# EAGLE design SensorStick (EAGLE 7.6.0)
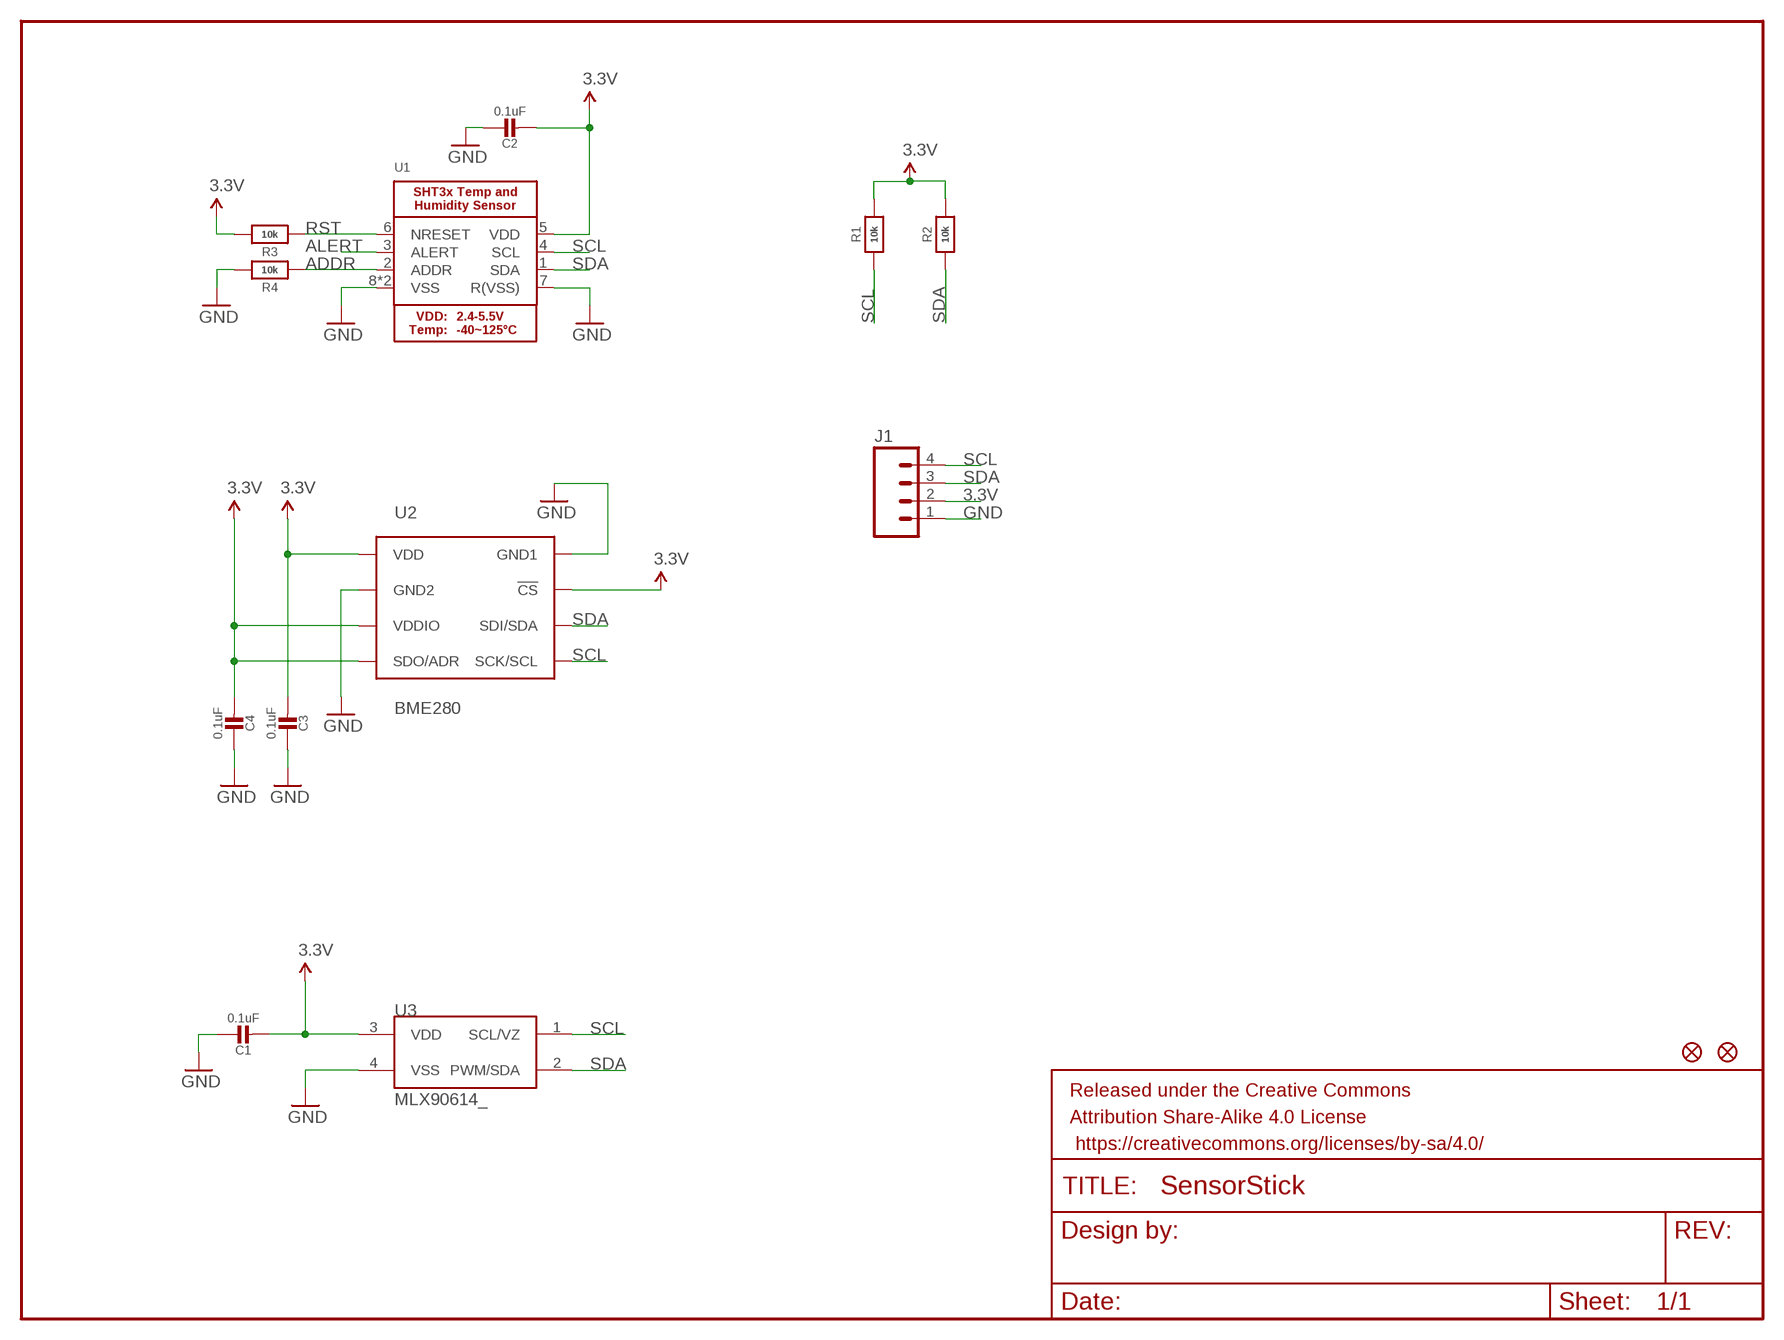
[diagram p0: schematic, sheet 1]

## Parts
C1  0.1uF  CAP_CERAMIC_0805  [_0805]
C2  0.1uF  CAP_CERAMIC_0805  [_0805]
C3  0.1uF  CAP_CERAMIC_0805  [_0805]
C4  0.1uF  CAP_CERAMIC_0805  [_0805]
FID1  SPARKFUN-AESTHETICS_FIDUCIAL1X2  [SPARKFUN-AESTHETICS_FIDUCIAL-1X2]
FID2  SPARKFUN-AESTHETICS_FIDUCIAL1X2  [SPARKFUN-AESTHETICS_FIDUCIAL-1X2]
FRAME1  FRAME-LETTERNO_PACKAGE  [DUMMY]
J1  M04PTH  [1X04]
R1  10k  RESISTOR_0805  [_0805]
R2  10k  RESISTOR_0805  [_0805]
R3  10k  RESISTOR_0805  [_0805]
R4  10k  RESISTOR_0805  [_0805]
U1  SHT3X  [SHT3X]
U2  BME280  BME280COMPONENTLIBRARY_BME280  [BME280COMPONENTLIBRARY_BME280_LGA]
U3  MLX90614_  [TO-39]

## Nets
3.3V: C1.2 C2.2 C3.2 C4.2 J1.2 R1.2 R2.2 R3.2 U1.5(VDD) U2.P$2(!CS) U2.P$5(SDO/ADR) U2.P$6(VDDIO) U2.P$8(VDD) U3.3(VDD)
ADDR: R4.1 U1.2(ADDR)
ALERT: U1.3(ALERT)
GND: C1.1 C2.1 C3.1 C4.1 J1.1 R4.2 U1.7(R(VSS)) U1.8(VSS) U1.THERMAL(VSS) U2.P$1(GND1) U2.P$7(GND2) U3.4(VSS)
RST: R3.1 U1.6(NRESET)
SCL: J1.4 R1.1 U1.4(SCL) U2.P$4(SCK/SCL) U3.1(SCL/VZ)
SDA: J1.3 R2.1 U1.1(SDA) U2.P$3(SDI/SDA) U3.2(PWM/SDA)

## Library data of the parts
C1-C4 = Adafruit-SHT31-Breakout:CAP_CERAMIC: Ceramic Capacitors For new designs, use the packages preceded by an '_' character since they are more reliable: The following footprints should be used on most boards: _0402 - Standard footprint for regular board layouts _0603 - Standard footprint for regular board layouts _0805 - Standard footprint for regular board layouts _1206 - Standard footprint for regular board layouts For extremely tight-pitch boards where space is at a premium, the following 'micro-pitch' footprints can be used (smaller pads, no silkscreen outline, etc.): _0402MP - Micro-pitch footprint for very dense/compact boards _0603MP - Micro-pitch footprint for very dense/compact boards _0805MP - Micro-pitch footprint for very dense/compact boards _1206MP - Micro-pitch footprint for very dense/compact boards
FID1 FID2 = SparkFun_BME280_Breakout:SPARKFUN-AESTHETICS_FIDUCIAL: Fiducial Alignment Points Various fiducial points for machine vision alignment.
FRAME1 = SparkFun-Aesthetics:FRAME-LETTER: Schematic Frame Standard 8.5x11 US Letter frame; DESIGNER: Nobody; VERSION: v01
J1 = SparkFun-Connectors:M04: Header 4 Standard 4-pin 0.1" header. Use with straight break away headers (SKU : PRT-00116), right angle break away headers (PRT-00553), swiss pins (PRT-00743), machine pins (PRT-00117), and female headers (PRT-00115). Molex polarized connector foot print use with SKU : PRT-08231 with associated crimp pins and housings. 1MM SMD Version SKU: PRT-10208; PROD_ID: CONN-09696
R1-R4 = Adafruit-SHT31-Breakout:RESISTOR: Resistors For new designs, use the packages preceded by an '_' character since they are more reliable: The following footprints should be used on most boards: _0402 - Standard footprint for regular board layouts _0603 - Standard footprint for regular board layouts _0805 - Standard footprint for regular board layouts _1206 - Standard footprint for regular board layouts For extremely tight-pitch boards where space is at a premium, the following 'micro-pitch' footprints can be used (smaller pads, no silkscreen outline, etc.): _0402MP - Micro-pitch footprint for very dense/compact boards _0603MP - Micro-pitch footprint for very dense/compact boards _0805MP - Micro-pitch footprint for very dense/compact boards _1206MP - Micro-pitch footprint for very dense/compact boards
U1 = Adafruit-SHT31-Breakout:SHT3X: SHT3x - Digital Temperature and Humidity Sensor Supply Voltage: 2.4-5.5V Humidity Accuracy: SHT30 = +/-3%RH, SHT31 = +/-2%RH Temperature Sensor: -40~125°C (+/-0.3°C from 10-55C)
U2 = SparkFun_BME280_Breakout:BME280COMPONENTLIBRARY_BME280; PROD_ID: IC-13090
U3 = SparkFun_MLX90614_Eval:MLX90614: Melexis IR Thermometer

## Board
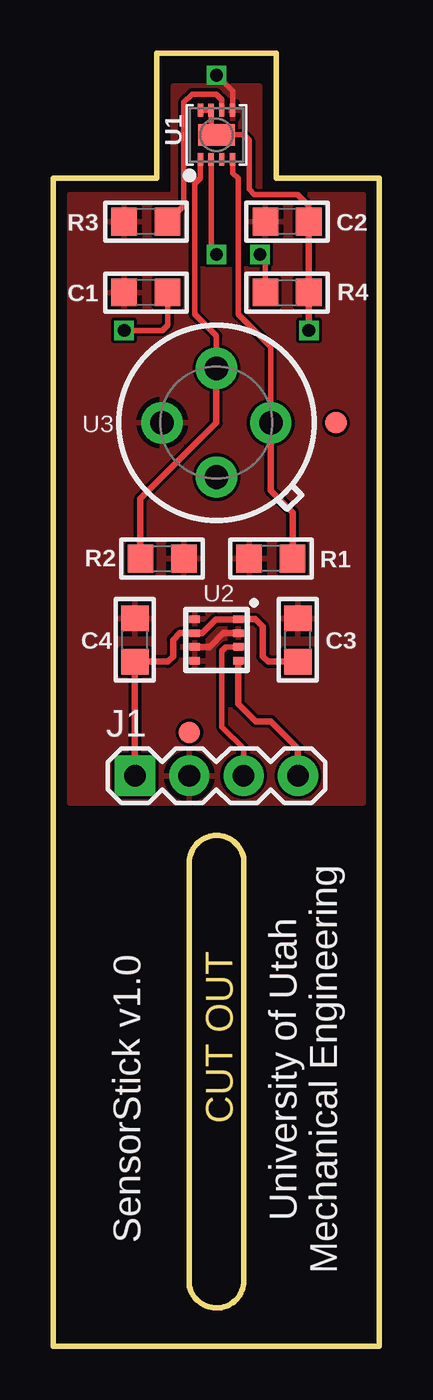
[diagram p1: board, top side]
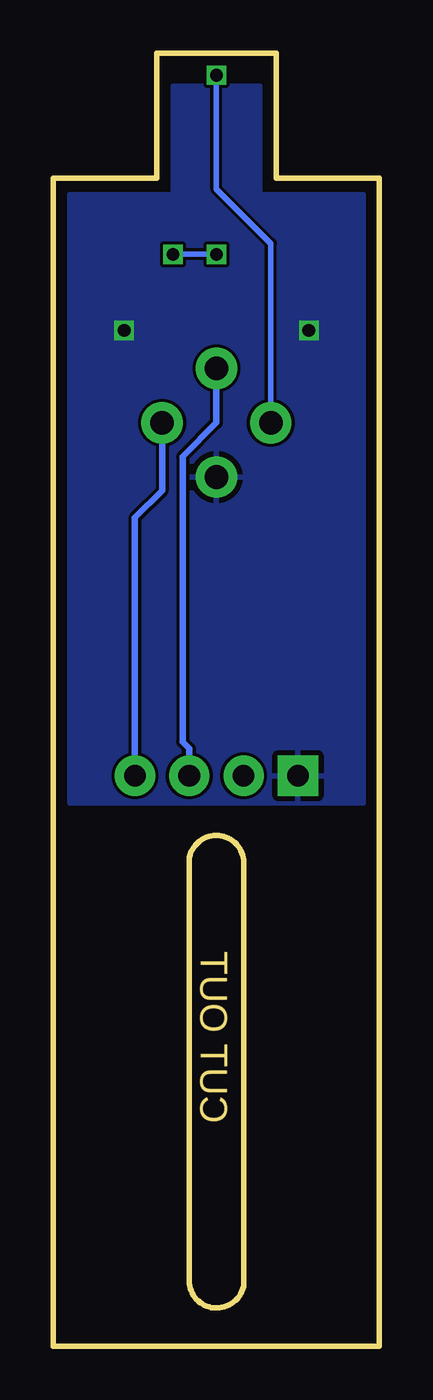
[diagram p2: board, bottom side, seen from below]

Size 15.24 x 60.45 mm. Coordinates in mm from the lower left corner, seen from the top.
Outline: 0,0 0,54.61 4.83,54.61 4.83,60.45 10.41,60.45 10.41,54.61 15.24,54.61 15.24,0 0,0
Outline: 6.35,2.79 6.35,22.61 arc-90 7.62,23.88 arc-77 8.89,22.86 8.89,3.05 arc-90 7.62,1.78 arc-77 6.35,2.79
Copper layers (1*16): Top 0.035mm / dielectric 1.5mm / Bottom 0.035mm
Design rules "SeeedStudio 2Layer": minimum track width 6mil, minimum drill 12mil, track to track 6mil, track to pad 6mil, pad to pad 6mil, via to via 6mil, smd to smd 0mil, copper to edge 10mil, drill to drill 10mil, minimum pad ring 10mil, minimum via ring 6mil, stop-mask expansion 2mil, vias tented up to drill 100mil, thermal gap 10mil

### Footprints (pad centres in the part's own frame; a part is rotated, then mirrored left to right if it is on the bottom)
_0805 = smd 1.2 x 1.3: 1 -1.016,0; 2 1.016,0
SPARKFUN-AESTHETICS_FIDUCIAL-1X2 = smd 1 x 1: 1 0,0
1X04 = drill 1.016 pad 1.88 square: 1 0,0 | drill 1.016 pad 1.88: 2 2.54,0; 3 5.08,0; 4 7.62,0
SHT3X = smd 0.6 x 0.25: 1 -1.15,0.75; 2 -1.15,0.25; 3 -1.15,-0.25; 4 -1.15,-0.75; 5 1.15,-0.75; 6 1.15,-0.25; 7 1.15,0.25; 8 1.15,0.75 | smd 1 x 1.7: THERMAL 0,0
BME280COMPONENTLIBRARY_BME280_LGA = smd 0.5 x 0.35: P$1 1.025,0.975; P$2 1.025,0.325; P$3 1.025,-0.325; P$4 1.025,-0.975; P$5 -1.025,-0.975; P$6 -1.025,-0.325; P$7 -1.025,0.325; P$8 -1.025,0.975
TO-39 = drill 1.1 pad 1.93: 1 2.54,0; 2 0,2.54; 3 -2.54,0; 4 0,-2.54

### Placement (x,y rotation side)
C1  4.32,49.28 180 top
C2  10.92,52.58 180 top
C3  11.43,33.02 90 top
C4  3.81,33.02 90 top
FID1  6.35,28.7 0 top
FID2  13.21,43.18 0 top
FRAME1  0,0 0 top
J1  3.81,26.67 0 top
R1  10.16,36.83 180 top
R2  5.08,36.83 0 top
R3  4.32,52.58 180 top
R4  10.92,49.28 0 top
U1  7.62,56.64 90 top
U2  7.62,33.02 0 top
U3  7.62,43.18 0 top

### Tracks (layer width: path | path; a pad name or v marks a point on that pad's centre or on a via)
3.3V  (via drill 0.6)
  Top 0.254: U1.5 8.37,58.69 v7.62,59.44
  Top 0.305: U2.P$2 7.95,33.34 7.29,32.7 U2.P$6
  Bottom 0.254: U3.3 5.08,51.56 7.62,54.1 v7.62,59.44
  pour Top: 0.76,25.4 14.48,25.4 14.48,53.85 9.65,53.85 9.65,58.93 5.59,58.93 5.59,53.85 0.76,53.85
ADDR  (via drill 0.6)
  Top 0.254: U1.2 7.37,51.3 v7.62,51.05 | v9.65,51.05 9.91,50.8 R4.1
  Bottom 0.254: v7.62,51.05 v9.65,51.05
GND  (via drill 0.6)
  Top 0.254: U1.8 U1.7 7.37,56.89 | U1.THERMAL 8.89,56.64 9.14,56.39 9.14,54.1 9.4,53.85 11.43,53.85 11.94,53.34 C2.1 | C1.1 5.33,47.75 5.08,47.5 v3.3,47.5
  Top 0.305: J1.1 C4.1 5.33,32 5.59,32.26 5.59,33.02 5.91,33.34 U2.P$7 6.95,33.34 7.59,33.98 8.63,33.98 U2.P$1 9.44,33.99 9.78,33.66 9.78,32.26 10.03,32 C3.1 | C2.1 R4.2 v11.94,47.5 | 7.37,56.89 U1.THERMAL
  pour Bottom: 0.76,25.4 14.48,25.4 14.48,25.65 14.48,33.53 14.48,49.78 14.48,53.85 10.67,53.85 9.65,53.85 9.65,58.93 5.59,58.93 5.59,58.67 5.59,53.85 0.76,53.85
RST
  Top 0.254: R3.1 6.1,53.34 6.1,58.17 6.48,58.55 7.62,58.55 7.87,58.3 U1.6
SCL
  Top 0.254: U3.1 10.16,46.74 8.64,48.26 8.64,54.61 8.38,54.86 8.38,55.48 U1.4
  Top 0.305: J1.4 11.43,27.94 10.16,29.21 9.45,29.21 8.64,30.02 8.64,32.04 U2.P$4 | R1.1 11.18,38.99 10.16,40.01 U3.1
  Bottom 0.305: U3.1 10.16,40.01 11.43,38.73 J1.4
SDA
  Top 0.254: U3.2 7.62,47.24 6.6,48.26 6.6,54.36 6.86,54.61 6.86,55.48 U1.1 | U2.P$3 8.06,32.7 7.87,32.51 7.87,28.96 8.89,27.94 J1.3
  Top 0.305: R2.1 4.06,39.62 7.62,43.18 U3.2
  Bottom 0.305: U3.2 7.62,43.18 9.21,41.59 9.21,28.26 8.89,27.94 J1.3

### Text on the board
Dimension: CUT OUT
tPlace: University of Utah / Mechanical Engineering | SensorStick v1.0